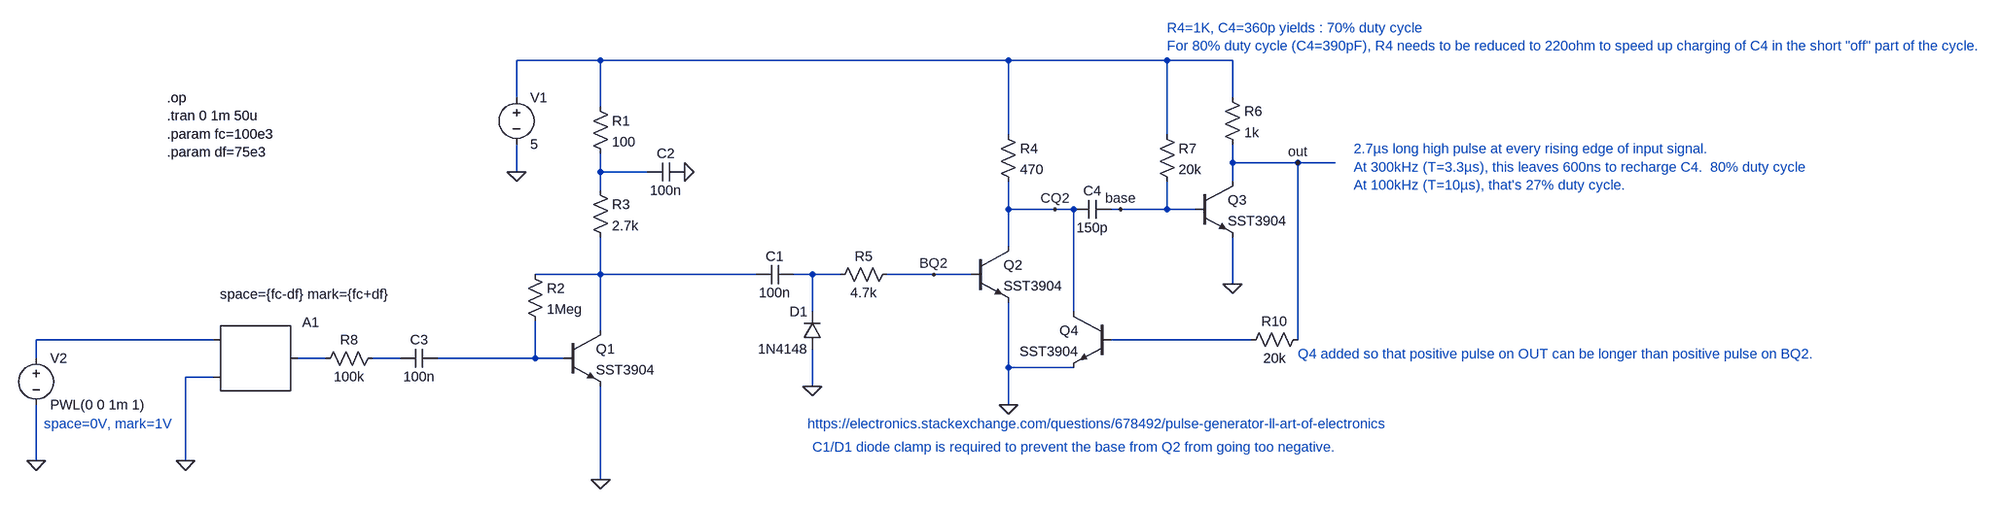
[diagram p0: schematic detector.asc]
detector.asc, the LTspice schematic file:
Version 4
SHEET 1 2412 680
WIRE -288 -368 -432 -368
WIRE 624 -368 -288 -368
WIRE 896 -368 624 -368
WIRE 1008 -368 896 -368
WIRE -432 -304 -432 -368
WIRE 1008 -304 1008 -368
WIRE -288 -288 -288 -368
WIRE 624 -240 624 -368
WIRE 896 -240 896 -368
WIRE 1008 -192 1008 -224
WIRE 1120 -192 1008 -192
WIRE 1184 -192 1120 -192
WIRE -432 -176 -432 -224
WIRE -288 -176 -288 -208
WIRE -208 -176 -288 -176
WIRE 1008 -160 1008 -192
WIRE -288 -144 -288 -176
WIRE 624 -112 624 -160
WIRE 704 -112 624 -112
WIRE 736 -112 704 -112
WIRE 816 -112 800 -112
WIRE 896 -112 896 -160
WIRE 896 -112 816 -112
WIRE 944 -112 896 -112
WIRE 624 -48 624 -112
WIRE -288 0 -288 -64
WIRE -288 0 -400 0
WIRE 192 0 -288 0
WIRE 288 0 256 0
WIRE 336 0 288 0
WIRE 496 0 416 0
WIRE 560 0 496 0
WIRE 1008 16 1008 -64
WIRE 288 64 288 0
WIRE 736 64 736 -112
WIRE -288 96 -288 0
WIRE -976 112 -1280 112
WIRE 1040 112 800 112
WIRE 1120 112 1120 -192
WIRE -1280 144 -1280 112
WIRE -784 144 -832 144
WIRE -656 144 -704 144
WIRE -400 144 -400 80
WIRE -400 144 -592 144
WIRE -352 144 -400 144
WIRE 624 160 624 48
WIRE 736 160 624 160
WIRE -976 176 -1024 176
WIRE 288 192 288 128
WIRE 624 224 624 160
WIRE -1280 320 -1280 224
WIRE -1024 320 -1024 176
WIRE -288 352 -288 192
FLAG -288 352 0
FLAG -144 -176 0
FLAG -432 -176 0
FLAG 624 224 0
FLAG 1008 16 0
FLAG 1120 -192 out
FLAG 816 -112 base
FLAG 288 192 0
FLAG 704 -112 CQ2
FLAG 496 0 BQ2
FLAG -1024 320 0
FLAG -1280 320 0
DATAFLAG -496 144 ""
DATAFLAG 160 0 ""
DATAFLAG 656 -112 ""
DATAFLAG 912 112 ""
DATAFLAG 912 -112 ""
DATAFLAG 1056 -192 ""
SYMBOL npn -352 96 R0
SYMATTR InstName Q1
SYMATTR Value SST3904
SYMBOL res -304 -304 R0
SYMATTR InstName R1
SYMATTR Value 100
SYMBOL cap -144 -192 R90
WINDOW 0 0 32 VBottom 2
WINDOW 3 32 32 VTop 2
SYMATTR InstName C2
SYMATTR Value 100n
SYMBOL res -416 -16 R0
SYMATTR InstName R2
SYMATTR Value 1Meg
SYMBOL res -304 -160 R0
SYMATTR InstName R3
SYMATTR Value 2.7k
SYMBOL voltage -432 -320 R0
WINDOW 123 0 0 Left 0
WINDOW 39 0 0 Left 0
SYMATTR InstName V1
SYMATTR Value 5
SYMBOL cap -592 128 R90
WINDOW 0 0 32 VBottom 2
WINDOW 3 32 32 VTop 2
SYMATTR InstName C3
SYMATTR Value 100n
SYMBOL npn 560 -48 R0
SYMATTR InstName Q2
SYMATTR Value SST3904
SYMBOL res 608 -256 R0
SYMATTR InstName R4
SYMATTR Value 470
SYMBOL res 432 -16 R90
WINDOW 0 0 56 VBottom 2
WINDOW 3 32 56 VTop 2
SYMATTR InstName R5
SYMATTR Value 4.7k
SYMBOL cap 256 -16 R90
WINDOW 0 0 32 VBottom 2
WINDOW 3 32 32 VTop 2
SYMATTR InstName C1
SYMATTR Value 100n
SYMBOL cap 800 -128 R90
WINDOW 0 0 32 VBottom 2
WINDOW 3 32 32 VTop 2
SYMATTR InstName C4
SYMATTR Value 150p
SYMBOL npn 944 -160 R0
SYMATTR InstName Q3
SYMATTR Value SST3904
SYMBOL res 992 -320 R0
SYMATTR InstName R6
SYMATTR Value 1k
SYMBOL res 880 -256 R0
SYMATTR InstName R7
SYMATTR Value 20k
SYMBOL diode 304 128 R180
WINDOW 0 24 64 Left 2
WINDOW 3 24 0 Left 2
SYMATTR InstName D1
SYMATTR Value 1N4148
SYMBOL SpecialFunctions\\modulate -976 112 R0
WINDOW 3 11 -78 Left 2
SYMATTR Value space={fc-df} mark={fc+df}
SYMATTR InstName A1
SYMBOL res -688 128 R90
WINDOW 0 0 56 VBottom 2
WINDOW 3 32 56 VTop 2
SYMATTR InstName R8
SYMATTR Value 100k
SYMBOL voltage -1280 128 R0
WINDOW 123 0 0 Left 0
WINDOW 39 0 0 Left 0
SYMATTR InstName V2
SYMATTR Value PWL(0 0 1m 1)
SYMBOL npn 800 64 M0
SYMATTR InstName Q4
SYMATTR Value SST3904
SYMBOL res 1136 96 R90
WINDOW 0 0 56 VBottom 2
WINDOW 3 32 56 VTop 2
SYMATTR InstName R10
SYMATTR Value 20k
TEXT -1056 -304 Left 2 !.op\n.tran 0 1m 50u\n.param fc=100e3\n.param df=75e3
TEXT 280 256 Left 2 ;https://electronics.stackexchange.com/questions/678492/pulse-generator-ll-art-of-electronics
TEXT 288 296 Left 2 ;C1/D1 diode clamp is required to prevent the base from Q2 from going too negative.
TEXT 1120 136 Left 2 ;Q4 added so that positive pulse on OUT can be longer than positive pulse on BQ2.
TEXT 896 -424 Left 2 ;R4=1K, C4=360p yields : 70% duty cycle\nFor 80% duty cycle (C4=390pF), R4 needs to be reduced to 220ohm to speed up charging of C4 in the short "off" part of the cycle.
TEXT 1216 -216 Left 2 ;2.7µs long high pulse at every rising edge of input signal.\nAt 300kHz (T=3.3µs), this leaves 600ns to recharge C4.  80% duty cycle\nAt 100kHz (T=10µs), that's 27% duty cycle.
TEXT -1048 256 Right 2 ;space=0V, mark=1V

The netlist it stands for:
* detector.asc
Q1 N003 N009 0 0 SST3904
R1 N001 N002 100
C2 0 N002 100n
R2 N003 N009 1Meg
R3 N002 N003 2.7k
V1 N001 0 5
C3 N009 N008 100n
Q2 CQ2 BQ2 0 0 SST3904
R4 N001 CQ2 470
R5 BQ2 N004 4.7k
C1 N004 N003 100n
C4 base CQ2 150p
Q3 out base 0 0 SST3904
R6 N001 out 1k
R7 N001 base 20k
D1 0 N004 1N4148
A1 N005 0 0 0 0 0 N007 0 MODULATOR space={fc-df} mark={fc+df}
R8 N008 N007 100k
V2 N005 0 PWL(0 0 1m 1)
Q4 CQ2 N006 0 0 SST3904
R10 out N006 20k
.model D D
.lib standard.dio
.model NPN NPN
.model PNP PNP
.lib standard.bjt
.op
.tran 0 1m 50u
.param fc=100e3
.param df=75e3
* https://electronics.stackexchange.com/questions/678492/pulse-generator-ll-art-of-electronics
* C1/D1 diode clamp is required to prevent the base from Q2 from going too negative.
* Q4 added so that positive pulse on OUT can be longer than positive pulse on BQ2.
* R4=1K, C4=360p yields : 70% duty cycle
* For 80% duty cycle (C4=390pF), R4 needs to be reduced to 220ohm to speed up charging of C4 in the short "off" part of the cycle.
* 2.7µs long high pulse at every rising edge of input signal.
* At 300kHz (T=3.3µs), this leaves 600ns to recharge C4.  80% duty cycle
* At 100kHz (T=10µs), that's 27% duty cycle.
* space=0V, mark=1V
.backanno
.end